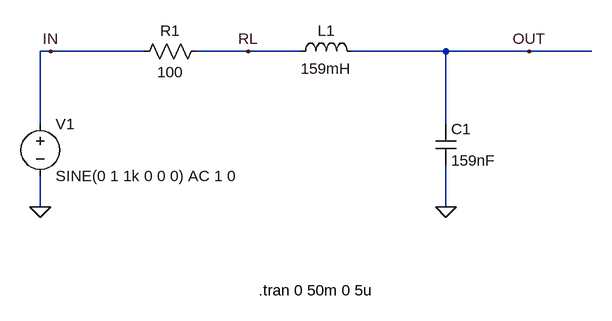
[diagram p0: schematic e2.asc]
e2.asc, the LTspice schematic file:
Version 4
SHEET 1 1108 680
WIRE 272 272 256 272
WIRE 416 272 272 272
WIRE 576 272 496 272
WIRE 656 272 576 272
WIRE 880 272 736 272
WIRE 1008 272 880 272
WIRE 1104 272 1008 272
WIRE 256 384 256 272
WIRE 880 384 880 272
WIRE 256 512 256 464
WIRE 880 512 880 448
FLAG 256 512 0
FLAG 880 512 0
FLAG 1008 272 OUT
FLAG 272 272 IN
FLAG 576 272 RL
SYMBOL voltage 256 368 R0
SYMATTR InstName V1
SYMATTR Value SINE(0 1 1k 0 0 0) AC 1 0
SYMBOL res 400 288 R270
WINDOW 0 32 56 VTop 2
WINDOW 3 0 56 VBottom 2
SYMATTR InstName R1
SYMATTR Value 100
SYMBOL ind 640 288 R270
WINDOW 0 32 56 VTop 2
WINDOW 3 5 56 VBottom 2
SYMATTR InstName L1
SYMATTR Value 159mH
SYMBOL cap 864 384 R0
SYMATTR InstName C1
SYMATTR Value 159nF
TEXT 592 640 Left 2 !.tran 0 50m 0 5u

The netlist it stands for:
* e2.asc
V1 IN 0 SINE(0 1 1k 0 0 0) AC 1 0
R1 IN RL 100
L1 RL OUT 159mH
C1 OUT 0 159nF
.tran 0 50m 0 5u
.backanno
.end